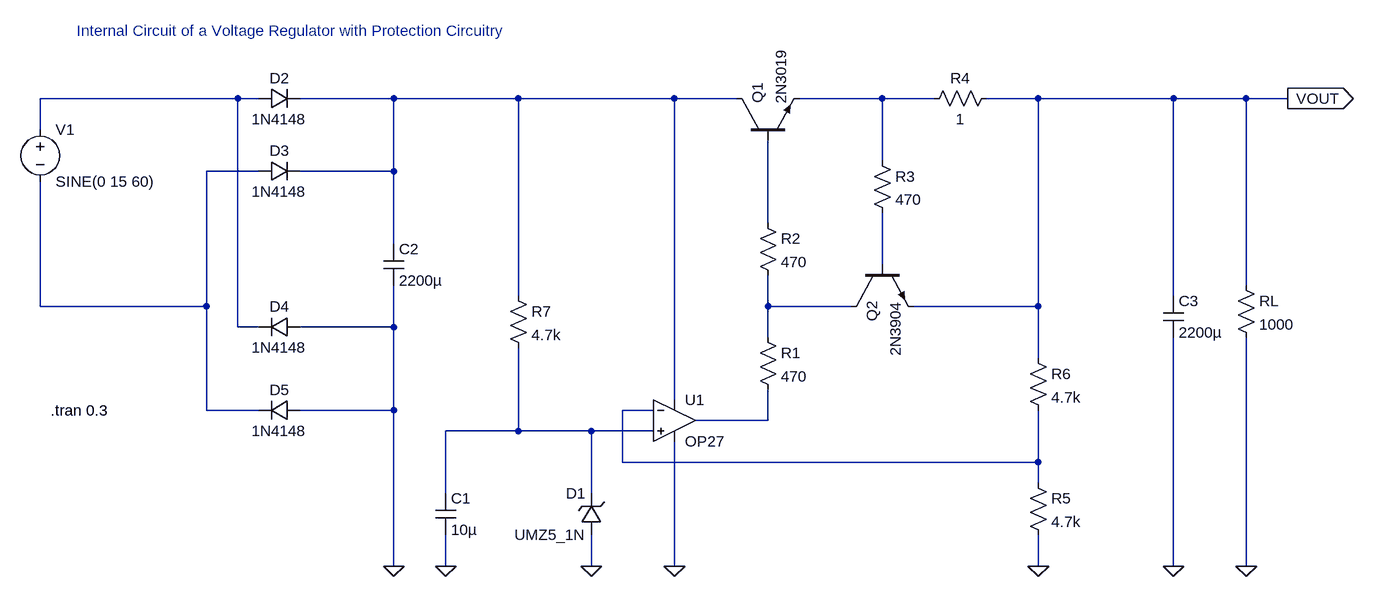
[diagram p0: schematic positive_voltage_regulator_with_protection.asc]
positive_voltage_regulator_with_protection.asc, the LTspice schematic file:
Version 4
SHEET 1 1404 680
WIRE -336 -464 -640 -464
WIRE -304 -464 -336 -464
WIRE -96 -464 -240 -464
WIRE 96 -464 -96 -464
WIRE 336 -464 96 -464
WIRE 432 -464 336 -464
WIRE 656 -464 528 -464
WIRE 736 -464 656 -464
WIRE 896 -464 816 -464
WIRE 1104 -464 896 -464
WIRE 1216 -464 1104 -464
WIRE 1280 -464 1216 -464
WIRE -640 -416 -640 -464
WIRE 656 -368 656 -464
WIRE -304 -352 -384 -352
WIRE -96 -352 -96 -464
WIRE -96 -352 -240 -352
WIRE 480 -272 480 -400
WIRE -96 -240 -96 -352
WIRE 656 -208 656 -288
WIRE 1216 -176 1216 -464
WIRE 96 -160 96 -464
WIRE 1104 -160 1104 -464
WIRE -640 -144 -640 -336
WIRE -384 -144 -384 -352
WIRE -384 -144 -640 -144
WIRE 480 -144 480 -192
WIRE 608 -144 480 -144
WIRE 896 -144 896 -464
WIRE 896 -144 704 -144
WIRE -336 -112 -336 -464
WIRE -304 -112 -336 -112
WIRE -96 -112 -96 -176
WIRE -96 -112 -240 -112
WIRE 480 -96 480 -144
WIRE 896 -64 896 -144
WIRE 336 0 336 -464
WIRE -384 16 -384 -144
WIRE -304 16 -384 16
WIRE -96 16 -96 -112
WIRE -96 16 -240 16
WIRE 304 16 256 16
WIRE 480 32 480 -16
WIRE 480 32 368 32
WIRE 96 48 96 -80
WIRE 96 48 -16 48
WIRE 208 48 96 48
WIRE 304 48 208 48
WIRE 256 96 256 16
WIRE 896 96 896 16
WIRE 896 96 256 96
WIRE 896 128 896 96
WIRE -16 144 -16 48
WIRE 208 144 208 48
WIRE -96 256 -96 16
WIRE -16 256 -16 208
WIRE 208 256 208 208
WIRE 336 256 336 64
WIRE 896 256 896 208
WIRE 1104 256 1104 -96
WIRE 1216 256 1216 -96
FLAG 896 256 0
FLAG 1280 -464 VOUT
IOPIN 1280 -464 Out
FLAG 208 256 0
FLAG -16 256 0
FLAG 336 256 0
FLAG -96 256 0
FLAG 1216 256 0
FLAG 1104 256 0
SYMBOL zener 224 208 R180
WINDOW 0 24 64 Left 2
WINDOW 3 24 0 Left 2
SYMATTR InstName D1
SYMATTR Value UMZ5_1N
SYMBOL OpAmps\\OP27 336 -32 R0
SYMATTR InstName U1
SYMBOL res 464 -112 R0
SYMATTR InstName R1
SYMATTR Value 470
SYMBOL res 464 -288 R0
SYMATTR InstName R2
SYMATTR Value 470
SYMBOL res 640 -384 R0
SYMATTR InstName R3
SYMATTR Value 470
SYMBOL res 832 -480 R90
WINDOW 0 0 56 VBottom 2
WINDOW 3 32 56 VTop 2
SYMATTR InstName R4
SYMATTR Value 1
SYMBOL res 880 112 R0
SYMATTR InstName R5
SYMATTR Value 4.7k
SYMBOL res 880 -80 R0
SYMATTR InstName R6
SYMATTR Value 4.7k
SYMBOL cap -32 144 R0
SYMATTR InstName C1
SYMATTR Value 10µ
SYMBOL res 80 -176 R0
SYMATTR InstName R7
SYMATTR Value 4.7k
SYMBOL diode -304 -448 R270
WINDOW 0 32 32 VTop 2
WINDOW 3 0 32 VBottom 2
SYMATTR InstName D2
SYMATTR Value 1N4148
SYMBOL diode -304 -336 R270
WINDOW 0 32 32 VTop 2
WINDOW 3 0 32 VBottom 2
SYMATTR InstName D3
SYMATTR Value 1N4148
SYMBOL diode -240 -96 M270
WINDOW 0 32 32 VTop 2
WINDOW 3 0 32 VBottom 2
SYMATTR InstName D4
SYMATTR Value 1N4148
SYMBOL diode -240 32 M270
WINDOW 0 32 32 VTop 2
WINDOW 3 0 32 VBottom 2
SYMATTR InstName D5
SYMATTR Value 1N4148
SYMBOL cap -112 -240 R0
SYMATTR InstName C2
SYMATTR Value 2200µ
SYMBOL voltage -640 -432 R0
WINDOW 123 0 0 Left 0
WINDOW 39 0 0 Left 0
SYMATTR InstName V1
SYMATTR Value SINE(0 15 60)
SYMBOL res 1200 -192 R0
SYMATTR InstName RL
SYMATTR Value 1000
SYMBOL npn 432 -400 R270
SYMATTR InstName Q1
SYMATTR Value 2N3019
SYMBOL npn 608 -208 M90
SYMATTR InstName Q2
SYMATTR Value 2N3904
SYMBOL cap 1088 -160 R0
SYMATTR InstName C3
SYMATTR Value 2200µ
TEXT -624 16 Left 2 !.tran 0.3
TEXT -584 -568 Left 2 ;Internal Circuit of a Voltage Regulator with Protection Circuitry

The netlist it stands for:
* positive_voltage_regulator_with_protection.asc
D1 0 N010 UMZ5_1N
XU1 N010 N008 N002 0 N009 OP27  ; pins In+ In- V+ V- OUT
R1 N007 N009 470
R2 N005 N007 470
R3 N003 N006 470
R4 VOUT N003 1
R5 N008 0 4.7k
R6 VOUT N008 4.7k
C1 N010 0 10µ
R7 N002 N010 4.7k
D2 N001 N002 1N4148
D3 N004 N002 1N4148
D4 0 N001 1N4148
D5 0 N004 1N4148
C2 N002 0 2200µ
V1 N001 N004 SINE(0 15 60)
RL VOUT 0 1000
Q1 N002 N005 N003 0 2N3019
Q2 N007 N006 VOUT 0 2N3904
C3 VOUT 0 2200µ
.model D D
.lib standard.dio
.model NPN NPN
.model PNP PNP
.lib standard.bjt
.tran 0.3
* Internal Circuit of a Voltage Regulator with Protection Circuitry
.lib ADI.lib
.backanno
.end